# Altium schematic sheet Sheet8.SchDoc
size A
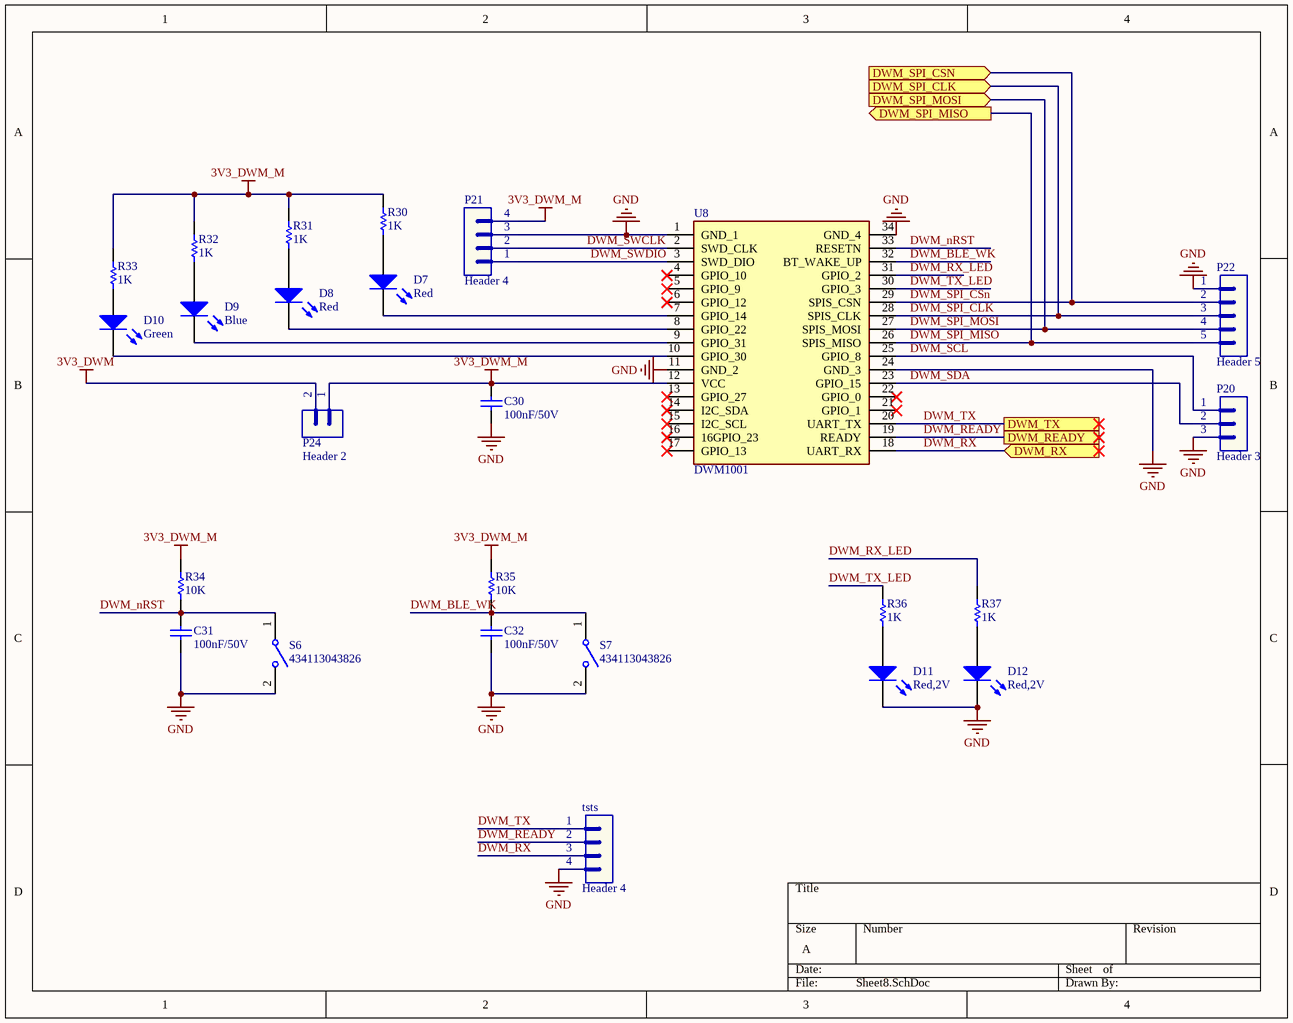
[diagram p0: Sheet8.SchDoc]

## Parts
C30  value 100nF/50V  [CAP-SM-0805]  (hidden comment: Cap-1nF-50V-0805)
C31  value 100nF/50V  [CAP-SM-0805]  (hidden comment: Cap-4.7uF-50V-0805)
C32  value 100nF/50V  [CAP-SM-0805]  (hidden comment: Cap-4.7uF-50V-0805)
D7  value Red  [LED-3mm]  (hidden comment: LED-RED-TH-3mm)
D8  value Red  [LED-3mm]  (hidden comment: LED-RED-TH-3mm)
D9  value Blue  [LED-3mm]  (hidden comment: LED-BLUE-TH-3mm)
D10  value Green  [LED-3mm]  (hidden comment: LED-GREEN-TH-3mm)
D11  value Red,2V  [LED-3mm]  (hidden comment: LED-RED-TH-3mm)
D12  value Red,2V  [LED-3mm]  (hidden comment: LED-RED-TH-3mm)
P20  Header 3  [JP3]
P21  Header 4  [JP4]
P22  Header 5  [JP5]
P24  Header 2  [JP2]
R30  value 1K  [RES-SM-0805]  (hidden comment: Res-0-0805)
R31  value 1K  [RES-SM-0805]  (hidden comment: Res-0-0805)
R32  value 1K  [RES-SM-0805]  (hidden comment: Res-0-0805)
R33  value 1K  [RES-SM-0805]  (hidden comment: Res-0-0805)
R34  value 10K  [RES-SM-0805]  (hidden comment: Res-1K-0805)
R35  value 10K  [RES-SM-0805]  (hidden comment: Res-1K-0805)
R36  value 1K  [RES-SM-0805]  (hidden comment: Res-1K-0805)
R37  value 1K  [RES-SM-0805]  (hidden comment: Res-1K-0805)
S6  434113043826  [434113043826]
S7  434113043826  [434113043826]
tsts  Header 4  [JP4]
U8  DWM1001  [DWM1001]

## Ports
DWM_READY, DWM_RX (in), DWM_SPI_CLK (in), DWM_SPI_CSN (in), DWM_SPI_MISO (out), DWM_SPI_MOSI (in), DWM_TX

## Nets
3V3_DWM: P24.2
3V3_DWM_M: C30.2 P21.4 P24.1 R30.2 R31.2 R32.2 R33.1 R34.2 R35.2 U8.12(VCC)
GND: C30.1 C31.1 C32.1 D11.2(K) D12.2(K) P20.3 P21.3 P22.1 S6.2 S7.2 tsts.4 U8.1(GND_1) U8.11(GND_2) U8.24(GND_3) U8.34(GND_4)
DWM_BLE_WK: C32.2 R35.1 S7.1 U8.32(BT_WAKE_UP)
DWM_nRST: C31.2 R34.1 S6.1 U8.33(RESETN)
DWM_READY: tsts.2 U8.19(READY) ; port DWM_READY
DWM_RX: tsts.3 U8.18(UART_RX) ; port DWM_RX
DWM_RX_LED: R37.2 U8.31(GPIO_2)
DWM_SCL: P20.1 U8.25(GPIO_8)
DWM_SDA: P20.2 U8.23(GPIO_15)
DWM_SPI_CLK: P22.3 U8.28(SPIS_CLK) ; port DWM_SPI_CLK
DWM_SPI_CSn: P22.2 U8.29(SPIS_CSN) ; port DWM_SPI_CSN
DWM_SPI_MISO: P22.5 U8.26(SPIS_MISO) ; port DWM_SPI_MISO
DWM_SPI_MOSI: P22.4 U8.27(SPIS_MOSI) ; port DWM_SPI_MOSI
DWM_SWCLK: P21.2 U8.2(SWD_CLK)
DWM_SWDIO: P21.1 U8.3(SWD_DIO)
DWM_TX: tsts.1 U8.20(UART_TX) ; port DWM_TX
DWM_TX_LED: R36.2 U8.30(GPIO_3)
NetD7_1: D7.1(A) R30.1
NetD7_2: D7.2(K) U8.7(GPIO_14)
NetD8_1: D8.1(A) R31.1
NetD8_2: D8.2(K) U8.8(GPIO_22)
NetD9_1: D9.1(A) R32.1
NetD9_2: D9.2(K) U8.9(GPIO_31)
NetD10_2: D10.2(K) U8.10(GPIO_30)
NetD11_1: D11.1(A) R36.1
NetD12_1: D12.1(A) R37.1

Not connected (* = marked no-connect by the designer): D10 1(A); R33 2; U8 4(GPIO_10)* 5(GPIO_9)* 6(GPIO_12)* 13(GPIO_27)* 14(I2C_SDA)* 15(I2C_SCL)* 16(16GPIO_23)* 17(GPIO_13)* 21(GPIO_1)* 22(GPIO_0)*

## Library data of the parts
C30 = Cap-1nF-50V-0805: CAP CER 1000PF 100V X7R 0805; Manufacturer: Johanson Dielectrics Inc.; Manufacturer Part Number: 101X15W102MV4E; Local Supplier: thegioiic; Local Supplier Link: https://thegioiic.com/products/tu-1nf-50v-0805; Supplier 1: Digikey; Supplier 1 Link: https://www.digikey.com/product-detail/en/johanson-dielectrics-inc/101X15W102MV4E/709-1335-1-ND/2327235; Supplier 1 Part Number: 709-1335-1-ND
C31 C32 = Cap-4.7uF-50V-0805: CAP CER 4.7UF 50V X5R 0805; Manufacturer: Murata Electronics; Manufacturer Part Number: GRM21BR61H475KE51L; Local Supplier: thegioiic; Local Supplier Link: https://thegioiic.com/products/tu-4-7uf-50v-0805-cap; Supplier 1: Digikey; Supplier 1 Link: https://www.digikey.com/product-detail/en/murata-electronics/GRM21BR61H475KE51L/490-10751-1-ND/5251349; Supplier 1 Part Number: 490-10751-1-ND
D7 D8 D11 D12 = LED-RED-TH-3mm: LED RED CLEAR T-1 T/H; Manufacturer: Kingbright; Manufacturer Part Number: WP710A10SEC/J3; Local Supplier: thegioiic; Local Supplier Link: https://thegioiic.com/products/led-do-3mm-chan-dai; Supplier 1: Digikey; Supplier 1 Link: https://www.digikey.com/product-detail/en/kingbright/WP710A10SEC-J3/754-1589-ND/2769815; Supplier 1 Part Number: 754-1589-ND
D9 = LED-BLUE-TH-3mm: LED BLUE CLEAR T-1 T/H; Manufacturer: Kingbright; Manufacturer Part Number: WP710A10QBC/D; Local Supplier: thegioiic; Local Supplier Link: https://thegioiic.com/products/led-xanh-duong-3mm-chan-dai; Supplier 1: Digikey; Supplier 1 Link: https://www.digikey.com/product-detail/en/kingbright/WP710A10QBC-D/754-1596-ND/2769812; Supplier 1 Part Number: 754-1596-ND
D10 = LED-GREEN-TH-3mm: LED GREEN CLEAR T-1 T/H; Manufacturer: Kingbright; Manufacturer Part Number: WP710A10ZGC/G; Local Supplier: thegioiic; Local Supplier Link: https://thegioiic.com/products/led-xanh-la-3mm-chan-dai; Supplier 1: Digikey; Supplier 1 Link: https://www.digikey.com/product-detail/en/kingbright/WP710A10ZGC-G/754-1612-ND/2769684; Supplier 1 Part Number: 754-1612-ND
P20 = Header 3: Header, 3-Pin; LatestRevisionDate: 17-Jul-2002; LatestRevisionNote: Re-released for DXP Platform.; Publisher: Altium Limited
P21 tsts = Header 4: Header, 4-Pin; LatestRevisionDate: 17-Jul-2002; LatestRevisionNote: Re-released for DXP Platform.; Publisher: Altium Limited
P22 = Header 5: Header, 5-Pin; LatestRevisionDate: 17-Jul-2002; LatestRevisionNote: Re-released for DXP Platform.; Publisher: Altium Limited
P24 = Header 2: Header, 2-Pin; LatestRevisionDate: 17-Jul-2002; LatestRevisionNote: Re-released for DXP Platform.; Publisher: Altium Limited
R30-R33 = Res-0-0805: RES 0 OHM JUMPER 0805; Manufacturer: Vishay Dale; Manufacturer Part Number: WSL080500000ZEA9; Local Supplier: thegioiic; Local Supplier Link: https://thegioiic.com/products/dien-tro-0-ohm-0805-5; Supplier 1: Digikey; Supplier 1 Link: https://www.digikey.com/product-detail/en/vishay-dale/WSL080500000ZEA9/541-3928-1-ND/7423223; Supplier 1 Part Number: 541-3928-1-ND
R34-R37 = Res-1K-0805: RES 1K OHM 1% 1/4W 0805; Manufacturer: Stackpole Electronics Inc; Manufacturer Part Number: RNCP0805FTD1K00; Local Supplier: thegioiic; Local Supplier Link: https://thegioiic.com/products/dien-tro-1k-ohm-0805-5; Supplier 1: Digikey; Supplier 1 Link: https://www.digikey.com/product-detail/en/stackpole-electronics-inc/RNCP0805FTD1K00/RNCP0805FTD1K00CT-ND/2240568; Supplier 1 Part Number: RNCP0805FTD1K00CT-ND
S6 S7 = 434113043826: WS-TASV J-Bend SMT Tact Switch 6x3.5mm, height 4.3mm, 260gf; Rated Voltage: 12VDC; Rated Current: 50mA; Washable: No; ComponentLink1Description: Manufacturer; ComponentLink1URL: http://www.we-online.de; ComponentLink2Description: Datasheet; ComponentLink2URL: https://katalog.we-online.com/em/datasheet/434113043826.pdf; Operating Temperature: -40 to +85degC; Part Number: 434113043826; Published Date: September 2019; Contact Material: Stainless Steel; Height: 4.3mm; Mounting Technology: SMT; Contact Plating: Silver; Operation Force: 260gf; Packaging: Tape and Reel; Terminal Material: Copper Alloy; Publisher: Wurth Elektronik; Terminal Plating: Silver
U8 = DWM1001: Manufacturer_Name: Decawave Limited; Datasheet Link: https://www.decawave.com/sites/default/files/dwm1001_datasheet.pdf; Height: 3mm; Manufacturer_Part_Number: DWM1001; Arrow Part Number: DWM1001